# EAGLE design core09e2 (EAGLE 6.6.0)

## Sheet 1 of 3
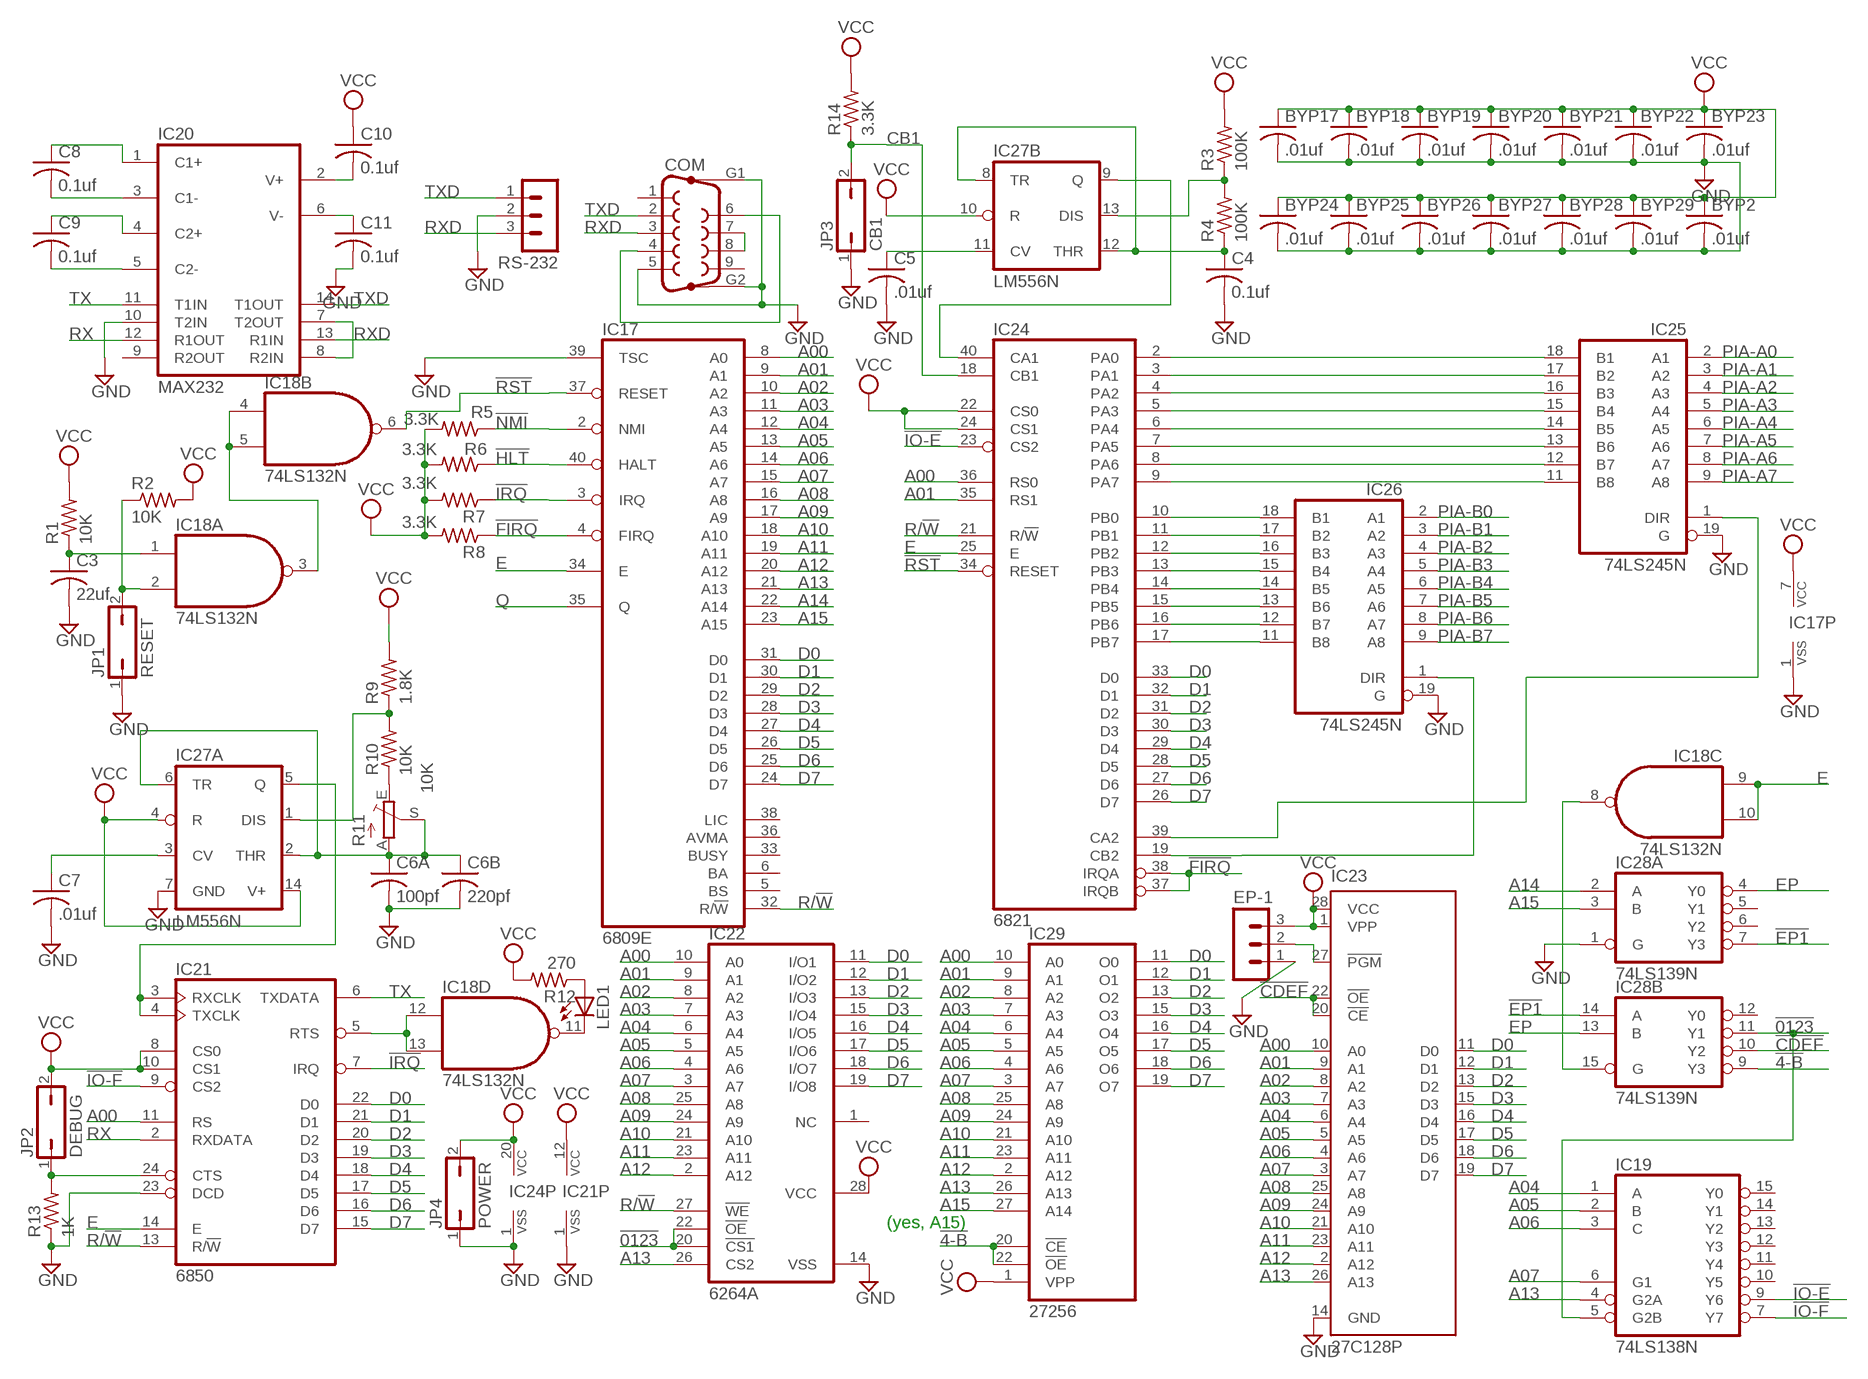
[diagram p0: schematic, sheet 1]

### Parts
BYP2  .01uf  C-US050-025X075  [C050-025X075]
BYP17  .01uf  C-US050-025X075  [C050-025X075]
BYP18  .01uf  C-US050-025X075  [C050-025X075]
BYP19  .01uf  C-US050-025X075  [C050-025X075]
BYP20  .01uf  C-US050-025X075  [C050-025X075]
BYP21  .01uf  C-US050-025X075  [C050-025X075]
BYP22  .01uf  C-US050-025X075  [C050-025X075]
BYP23  .01uf  C-US050-025X075  [C050-025X075]
BYP24  .01uf  C-US050-025X075  [C050-025X075]
BYP25  .01uf  C-US050-025X075  [C050-025X075]
BYP26  .01uf  C-US050-025X075  [C050-025X075]
BYP27  .01uf  C-US050-025X075  [C050-025X075]
BYP28  .01uf  C-US050-025X075  [C050-025X075]
BYP29  .01uf  C-US050-025X075  [C050-025X075]
C3  22uf  C-US102-054X133  [C102-054X133]
C4  0.1uf  C-US050-025X075  [C050-025X075]
C5  .01uf  C-US050-025X075  [C050-025X075]
C6A  100pf  C-US050-025X075  [C050-025X075]
C6B  220pf  C-US050-025X075  [C050-025X075]
C7  .01uf  C-US050-025X075  [C050-025X075]
C8  0.1uf  C-US050-025X075  [C050-025X075]
C9  0.1uf  C-US050-025X075  [C050-025X075]
C10  0.1uf  C-US050-025X075  [C050-025X075]
C11  0.1uf  C-US050-025X075  [C050-025X075]
COM  F09HP  [F09HP]
EP-1  MA03-1  [MA03-1]
IC17  6809E  [DIL40]
IC18  74LS132N  74LS00N  [DIL14]
IC19  74LS138N  [DIL16]
IC20  MAX232  [DIL16]
IC21  6850  [DIL24]
IC22  6264A  [DIL28-6]
IC23  27C128P  [DIL28-6]
IC24  6821  [DIL40]
IC25  74LS245N  [DIL20]
IC26  74LS245N  [DIL20]
IC27  LM556N  [DIL14]
IC28  74LS139N  [DIL16]
IC29  27256  [DIL28]
JP1  RESET  JP1Q  [JP1]
JP2  DEBUG  JP1Q  [JP1]
JP3  CB1  JP1Q  [JP1]
JP4  POWER  JP1Q  [JP1]
LED1  LED3MM  [LED3MM]
R1  10K  R-US_0207/7  [0207/7]
R2  10K  R-US_0207/7  [0207/7]
R3  100K  R-US_0207/7  [0207/7]
R4  100K  R-US_0207/7  [0207/7]
R5  3.3K  R-US_0207/7  [0207/7]
R6  3.3K  R-US_0207/7  [0207/7]
R7  3.3K  R-US_0207/7  [0207/7]
R8  3.3K  R-US_0207/7  [0207/7]
R9  1.8K  R-US_0207/7  [0207/7]
R10  10K  R-US_0207/7  [0207/7]
R11  10K  TRIM_EU-B90P  [SP19L]
R12  270  R-US_0207/7  [0207/7]
R13  1K  R-US_0207/7  [0207/7]
R14  3.3K  R-US_0207/7  [0207/7]
RS-232  MA03-1  [MA03-1]

### Nets
!4-B: IC28.9(B:Y3) IC29.20(!CE) IC29.22(!OE)
!0123: IC19.5(G2B) IC22.20(!CS1) IC22.22(!OE) IC28.11(B:Y1)
!CDEF: IC23.20(!CE) IC23.22(!OE) IC28.10(B:Y2)
!EP1: IC28.7(A:Y3) IC28.14(B:A)
!FIRQ: IC17.4(FIRQ) IC24.37(IRQB) IC24.38(IRQA) R8.1
!HLT: IC17.40(HALT) R5.1
!IO-E: IC19.9(Y6) IC24.23(CS2)
!IO-F: IC19.7(Y7) IC21.9(CS2)
!IRQ: IC17.3(IRQ) IC21.7(IRQ) R7.1
!NMI: IC17.2(NMI) R6.1
!RST: IC17.37(RESET) IC18.6(B:O) IC24.34(RESET)
A00: IC17.8(A0) IC21.11(RS) IC22.10(A0) IC23.10(A0) IC24.36(RS0) IC29.10(A0)
A01: IC17.9(A1) IC22.9(A1) IC23.9(A1) IC24.35(RS1) IC29.9(A1)
A02: IC17.10(A2) IC22.8(A2) IC23.8(A2) IC29.8(A2)
A03: IC17.11(A3) IC22.7(A3) IC23.7(A3) IC29.7(A3)
A04: IC17.12(A4) IC19.1(A) IC22.6(A4) IC23.6(A4) IC29.6(A4)
A05: IC17.13(A5) IC19.2(B) IC22.5(A5) IC23.5(A5) IC29.5(A5)
A06: IC17.14(A6) IC19.3(C) IC22.4(A6) IC23.4(A6) IC29.4(A6)
A07: IC17.15(A7) IC19.6(G1) IC22.3(A7) IC23.3(A7) IC29.3(A7)
A08: IC17.16(A8) IC22.25(A8) IC23.25(A8) IC29.25(A8)
A09: IC17.17(A9) IC22.24(A9) IC23.24(A9) IC29.24(A9)
A10: IC17.18(A10) IC22.21(A10) IC23.21(A10) IC29.21(A10)
A11: IC17.19(A11) IC22.23(A11) IC23.23(A11) IC29.23(A11)
A12: IC17.20(A12) IC22.2(A12) IC23.2(A12) IC29.2(A12)
A13: IC17.21(A13) IC19.4(G2A) IC22.26(CS2) IC23.26(A13) IC29.26(A13)
A14: IC17.22(A14) IC28.2(A:A)
A15: IC17.23(A15) IC28.3(A:B) IC29.27(A14)
CB1: IC24.18(CB1) JP3.2 R14.1
D0: IC17.31(D0) IC21.22(D0) IC22.11(I/O1) IC23.11(D0) IC24.33(D0) IC29.11(O0)
D1: IC17.30(D1) IC21.21(D1) IC22.12(I/O2) IC23.12(D1) IC24.32(D1) IC29.12(O1)
D2: IC17.29(D2) IC21.20(D2) IC22.13(I/O3) IC23.13(D2) IC24.31(D2) IC29.13(O2)
D3: IC17.28(D3) IC21.19(D3) IC22.15(I/O4) IC23.15(D3) IC24.30(D3) IC29.15(O3)
D4: IC17.27(D4) IC21.18(D4) IC22.16(I/O5) IC23.16(D4) IC24.29(D4) IC29.16(O4)
D5: IC17.26(D5) IC21.17(D5) IC22.17(I/O6) IC23.17(D5) IC24.28(D5) IC29.17(O5)
D6: IC17.25(D6) IC21.16(D6) IC22.18(I/O7) IC23.18(D6) IC24.27(D6) IC29.18(O6)
D7: IC17.24(D7) IC21.15(D7) IC22.19(I/O8) IC23.19(D7) IC24.26(D7) IC29.19(O7)
E: IC17.34(E) IC18.9(C:I0) IC18.10(C:I1) IC21.14(E) IC24.25(E) ; also sheet 3
EP: IC28.4(A:Y0) IC28.13(B:B)
GND [Power]: BYP2.2 BYP17.2 BYP18.2 BYP19.2 BYP20.2 BYP21.2 BYP22.2 BYP23.2 BYP24.2 BYP25.2 BYP26.2 BYP27.2 BYP28.2 BYP29.2 C3.2 C4.2 C5.2 C6A.2 C6B.2 C7.2 C11.2 COM.5 COM.G1 COM.G2 EP-1.1 IC17.1(VSS) IC17.39(TSC) IC20.10(T2IN) IC21.1(VSS) IC21.23(DCD) IC22.14(VSS) IC23.14(GND) IC24.1(VSS) IC25.19(G) IC26.19(G) IC27.7(A:GND) IC28.1(A:G) JP1.1 JP3.1 JP4.1 R13.1 RS-232.2 ; also sheet 2,3
N$1: COM.4 COM.6
N$4: EP-1.2 IC23.27(!PGM)
N$5: IC24.2(PA0) IC25.18(B1)
N$6: IC18.3(A:O) IC18.4(B:I0) IC18.5(B:I1)
N$21: C3.1 IC18.1(A:I0) R1.1
N$22: IC18.2(A:I1) JP1.2 R2.1
N$23: IC21.3(RXCLK) IC21.4(TXCLK) IC27.5(A:Q)
N$24: IC24.10(PB0) IC26.18(B1)
N$25: IC24.11(PB1) IC26.17(B2)
N$27: C6A.1 C6B.1 IC27.2(A:THR) IC27.6(A:TR) R11.A R11.S
N$28: IC27.1(A:DIS) R9.1 R10.2
N$94: IC24.12(PB2) IC26.16(B3)
N$124: IC24.13(PB3) IC26.15(B4)
N$125: IC24.14(PB4) IC26.14(B5)
N$126: IC24.15(PB5) IC26.13(B6)
N$127: IC24.16(PB6) IC26.12(B7)
N$128: IC24.17(PB7) IC26.11(B8)
N$129: IC24.3(PA1) IC25.17(B2)
N$130: IC24.4(PA2) IC25.16(B3)
N$131: IC24.5(PA3) IC25.15(B4)
N$132: IC24.6(PA4) IC25.14(B5)
N$133: IC24.7(PA5) IC25.13(B6)
N$134: IC24.8(PA6) IC25.12(B7)
N$135: IC24.9(PA7) IC25.11(B8)
N$136: IC24.19(CB2) IC26.1(DIR)
N$137: IC24.39(CA2) IC25.1(DIR)
N$138: IC24.40(CA1) IC27.9(B:Q)
N$140: C4.1 IC27.8(B:TR) IC27.12(B:THR) R4.1
N$141: IC27.13(B:DIS) R3.1 R4.2
N$142: C5.1 IC27.11(B:CV)
N$143: R10.1 R11.E
N$145: COM.7 COM.8
N$147: IC18.12(D:I0) IC18.13(D:I1) IC21.5(RTS)
N$148: IC18.11(D:O) LED1.K(C)
N$149: LED1.A R12.1
N$150: IC21.24(CTS) JP2.1 R13.2
N$151: IC18.8(C:O) IC28.15(B:G)
N$153: IC20.7(T2OUT) IC20.8(R2IN)
N$154: C7.1 IC27.3(A:CV)
N$155: C9.2 IC20.5(C2-)
N$156: C9.1 IC20.4(C2+)
N$157: C8.2 IC20.3(C1-)
N$158: C8.1 IC20.1(C1+)
N$159: C11.1 IC20.6(V-)
N$160: C10.2 IC20.2(V+)
PIA-A0: IC25.2(A1) ; also sheet 2
PIA-A1: IC25.3(A2) ; also sheet 2
PIA-A2: IC25.4(A3) ; also sheet 2
PIA-A3: IC25.5(A4) ; also sheet 2
PIA-A4: IC25.6(A5) ; also sheet 2
PIA-A5: IC25.7(A6) ; also sheet 2
PIA-A6: IC25.8(A7) ; also sheet 2
PIA-A7: IC25.9(A8) ; also sheet 2
PIA-B0: IC26.2(A1) ; also sheet 2
PIA-B1: IC26.3(A2) ; also sheet 2
PIA-B2: IC26.4(A3) ; also sheet 2
PIA-B3: IC26.5(A4) ; also sheet 2
PIA-B4: IC26.6(A5) ; also sheet 2
PIA-B5: IC26.7(A6) ; also sheet 2
PIA-B6: IC26.8(A7) ; also sheet 2
PIA-B7: IC26.9(A8) ; also sheet 2
Q: IC17.35(Q) ; also sheet 3
R/!W: IC17.32(R/!W) IC21.13(R/!W) IC22.27(!WE) IC24.21(R/!W)
RX: IC20.12(R1OUT) IC21.2(RXDATA)
RXD: COM.3 IC20.13(R1IN) RS-232.3
TX: IC20.11(T1IN) IC21.6(TXDATA)
TXD: COM.2 IC20.14(T1OUT) RS-232.1
VCC [Power]: BYP2.1 BYP17.1 BYP18.1 BYP19.1 BYP20.1 BYP21.1 BYP22.1 BYP23.1 BYP24.1 BYP25.1 BYP26.1 BYP27.1 BYP28.1 BYP29.1 C10.1 EP-1.3 IC17.7(VCC) IC21.8(CS0) IC21.10(CS1) IC21.12(VCC) IC22.28(VCC) IC23.1(VPP) IC23.28(VCC) IC24.20(VCC) IC24.22(CS0) IC24.24(CS1) IC27.4(A:R) IC27.10(B:R) IC27.14(A:V+) IC29.1(VPP) JP2.2 JP4.2 R1.2 R2.2 R3.2 R5.2 R6.2 R7.2 R8.2 R9.2 R12.2 R14.2 ; also sheet 2,3
Unconnected: COM.1 COM.9 IC17.5(BS) IC17.6(BA) IC17.33(BUSY) IC17.36(AVMA) IC17.38(LIC) IC19.10(Y5) IC19.11(Y4) IC19.12(Y3) IC19.13(Y2) IC19.14(Y1) IC19.15(Y0) IC20.9(R2OUT) IC22.1(NC) IC28.5(A:Y1) IC28.6(A:Y2) IC28.12(B:Y0)

### Notes on the sheet
- (yes, A15)

## Sheet 2 of 3
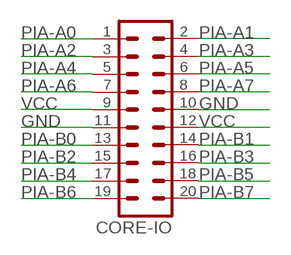
[diagram p1: schematic, sheet 2]

### Parts
CORE-IO  MA10-2  [MA10-2]

### Nets
GND [Power]: CORE-IO.10 CORE-IO.11 ; also sheet 1,3
PIA-A0: CORE-IO.1 ; also sheet 1
PIA-A1: CORE-IO.2 ; also sheet 1
PIA-A2: CORE-IO.3 ; also sheet 1
PIA-A3: CORE-IO.4 ; also sheet 1
PIA-A4: CORE-IO.5 ; also sheet 1
PIA-A5: CORE-IO.6 ; also sheet 1
PIA-A6: CORE-IO.7 ; also sheet 1
PIA-A7: CORE-IO.8 ; also sheet 1
PIA-B0: CORE-IO.13 ; also sheet 1
PIA-B1: CORE-IO.14 ; also sheet 1
PIA-B2: CORE-IO.15 ; also sheet 1
PIA-B3: CORE-IO.16 ; also sheet 1
PIA-B4: CORE-IO.17 ; also sheet 1
PIA-B5: CORE-IO.18 ; also sheet 1
PIA-B6: CORE-IO.19 ; also sheet 1
PIA-B7: CORE-IO.20 ; also sheet 1
VCC [Power]: CORE-IO.9 CORE-IO.12 ; also sheet 1,3

## Sheet 3 of 3
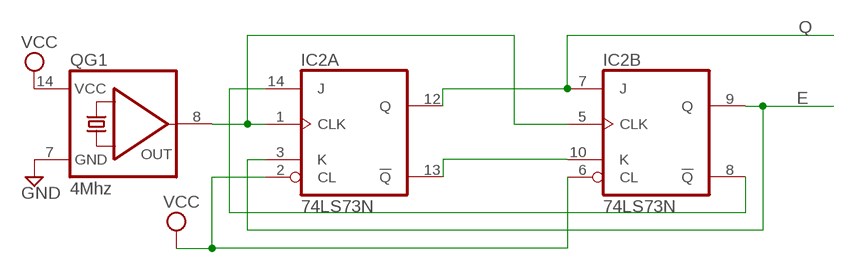
[diagram p2: schematic, sheet 3]

### Parts
IC2  74LS73N  [DIL14]
QG1  4Mhz  QG5860  [DIL14S]

### Nets
E: IC2.3(A:K) IC2.9(B:Q) ; also sheet 1
GND [Power]: QG1.7(GND) ; also sheet 1,2
N$2: IC2.1(A:CLK) IC2.5(B:CLK) QG1.8(OUT)
N$3: IC2.10(B:K) IC2.13(A:!Q)
N$7: IC2.8(B:!Q) IC2.14(A:J)
Q: IC2.7(B:J) IC2.12(A:Q) ; also sheet 1
VCC [Power]: IC2.2(A:CL) IC2.6(B:CL) QG1.14(VCC) ; also sheet 1,2

## Power pins joined to a net without a drawn wire
GND: IC2.11(P:GND) IC18.7(P:GND) IC19.8(GND) IC20.15(GND) IC25.10(GND) IC26.10(GND) IC28.8(P:GND) IC29.14(GND)
VCC: IC2.4(P:VCC) IC18.14(P:VCC) IC19.16(VCC) IC20.16(VCC) IC25.20(VCC) IC26.20(VCC) IC28.16(P:VCC) IC29.28(VCC)

## Library data of the parts
BYP2 BYP17-BYP29 C3-C5 C6A C6B C7-C11 = rcl:C-US: CAPACITOR, American symbol
COM = con-subd:F09HP: SUB-D; OC_FARNELL: unknown; OC_NEWARK: unknown
CORE-IO = con-lstb:MA10-2: PIN HEADER; OC_FARNELL: unknown; OC_NEWARK: unknown
EP-1 RS-232 = con-lstb:MA03-1: PIN HEADER; OC_FARNELL: unknown; OC_NEWARK: unknown
IC2 = 74xx-us:74*73: Dual J-K FLIP FLOP, clear
IC17 = micro-motorola:6809E: MICROCONTROLLER/MEMORY DEVICE; MF: NTE ELECTRONICS; MPN: NTE6809E; OC_FARNELL: unknown; OC_NEWARK: 31C5318
IC18 = 74xx-us:74*00: Quad 2-input NAND gate
IC19 = 74xx-us:74*138: 3-line to 8-line DECODER/DEMULTIPLEXER
IC20 = maxim:MAX232: RS232 TRANSCEIVER; MF: MAXIM; MPN: MAX232ACPE+; OC_FARNELL: 9723773; OC_NEWARK: 68K4544
IC21 = micro-motorola:6850: MICROCONTROLLER/MEMORY DEVICE; MF: NTE ELECTRONICS; MPN: NTE6850; OC_FARNELL: 4899775; OC_NEWARK: 31C2457
IC22 = memory-hitachi:6264A: MEMORY; OC_FARNELL: 283605; OC_NEWARK: unknown
IC23 = microchip:27*128: CMOS EPROM 128 K (16 K x 8); OC_FARNELL: unknown; OC_NEWARK: unknown
IC24 = micro-motorola:6821: MICROCONTROLLER/MEMORY DEVICE; MF: NTE ELECTRONICS; MPN: NTE6821; OC_FARNELL: 1652403; OC_NEWARK: 29C4772
IC25 IC26 = 74xx-us:74*245: Octal BUS TRANSCEIVER, 3-state
IC27 = linear:*556: Dual TIMER
IC28 = 74xx-us:74*139: Dual 2-line to 4-line DECODER/DEMULTIPLEXER
IC29 = memory:27256: MEMORY
JP1-JP4 = jumper:JP1Q: JUMPER
LED1 = led:LED: LED OSRAM: - CHIPLED LG R971, LG N971, LY N971, LG Q971, LY Q971, LO R971, LY R971 LH N974, LH R974 LS Q976, LO Q976, LY Q976 LO Q996 - Hyper CHIPLED LW Q18S LB Q993, LB Q99A, LB R99A - SideLED LS A670, LO A670, LY A670, LG A670, LP A670 LB A673, LV A673, LT A673, LW A673 LH A674 LY A675 LS A676, LA A676, LO A676, LY A676, LW A676 LS A679, LY A679, LG A679 - Hyper Micro SIDELED® LS Y876, LA Y876, LO Y876, LY Y876 LT Y87S - SmartLED LW L88C, LW L88S LB L89C, LB L89S, LG L890 LS L89K, LO L89K, LY L89K LS L896, LA L896, LO L896, LY L896 - TOPLED LS T670, LO T670, LY T670, LG T670, LP T670 LSG T670, LSP T670, LSY T670, LOP T670, LYG T670 LG T671, LOG T671, LSG T671 LB T673, LV T673, LT T673, LW T673 LH T674 LS T676, LA T676, LO T676, LY T676, LB T676, LH T676, LSB T676, LW T676 LB T67C, LV T67C, LT T67C, LS T67K, LO T67K, LY T67K, LW E67C LS E67B, LA E67B, LO E67B, LY E67B, LB E67C, LV E67C, LT E67C LW T67C LS T679, LY T679, LG T679 LS T770, LO T770, LY T770, LG T770, LP T770 LB T773, LV T773, LT T773, LW T773 LH T774 LS E675, LA E675, LY E675, LS T675 LS T776, LA T776, LO T776, LY T776, LB T776 LHGB T686 LT T68C, LB T68C - Hyper Mini TOPLED® LB M676 - Mini TOPLED Santana® LG M470 LS M47K, LO M47K, LY M47K Source: http://www.osram.convergy.de LUXEON: - LUMILED® LXK2-PW12-R00, LXK2-PW12-S00, LXK2-PW14-U00, LXK2-PW14-V00 LXK2-PM12-R00, LXK2-PM12-S00, LXK2-PM14-U00 LXK2-PE12-Q00, LXK2-PE12-R00, LXK2-PE12-S00, LXK2-PE14-T00, LXK2-PE14-U00 LXK2-PB12-K00, LXK2-PB12-L00, LXK2-PB12-M00, LXK2-PB14-N00, LXK2-PB14-P00, LXK2-PB14-Q00 LXK2-PR12-L00, LXK2-PR12-M00, LXK2-PR14-Q00, LXK2-PR14-R00 LXK2-PD12-Q00, LXK2-PD12-R00, LXK2-PD12-S00 LXK2-PH12-R00, LXK2-PH12-S00 LXK2-PL12-P00, LXK2-PL12-Q00, LXK2-PL12-R00 Source: www.luxeon.com KINGBRIGHT: KA-3528ASYC Source: www.kingbright.com
QG1 = crystal:QG5860: CRYSTAL RESONATOR; OC_FARNELL: unknown; OC_NEWARK: unknown
R1-R10 R12-R14 = rcl:R-US_: RESISTOR, American symbol
R11 = pot:TRIM_EU-: POTENTIOMETER

## Net classes
1 Power: width 0.508 mm, drill 0.254 mm, clearance 0.254 mm

## Board
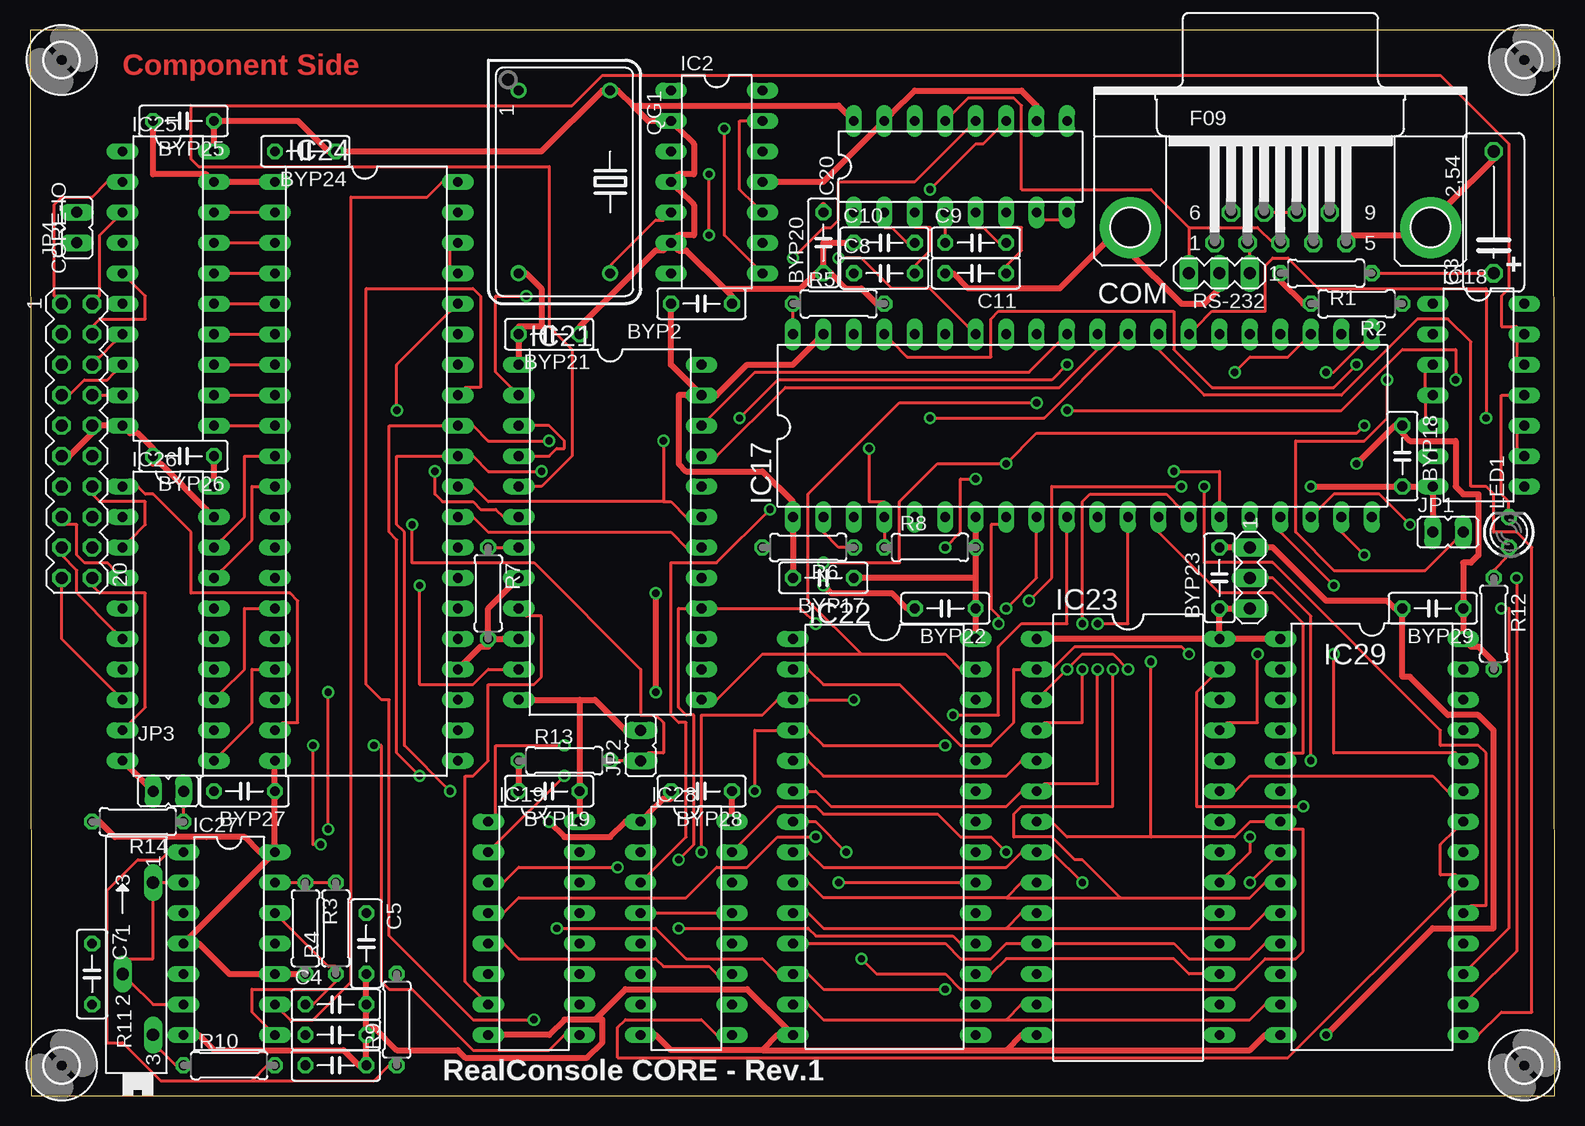
[diagram p3: board, top side]
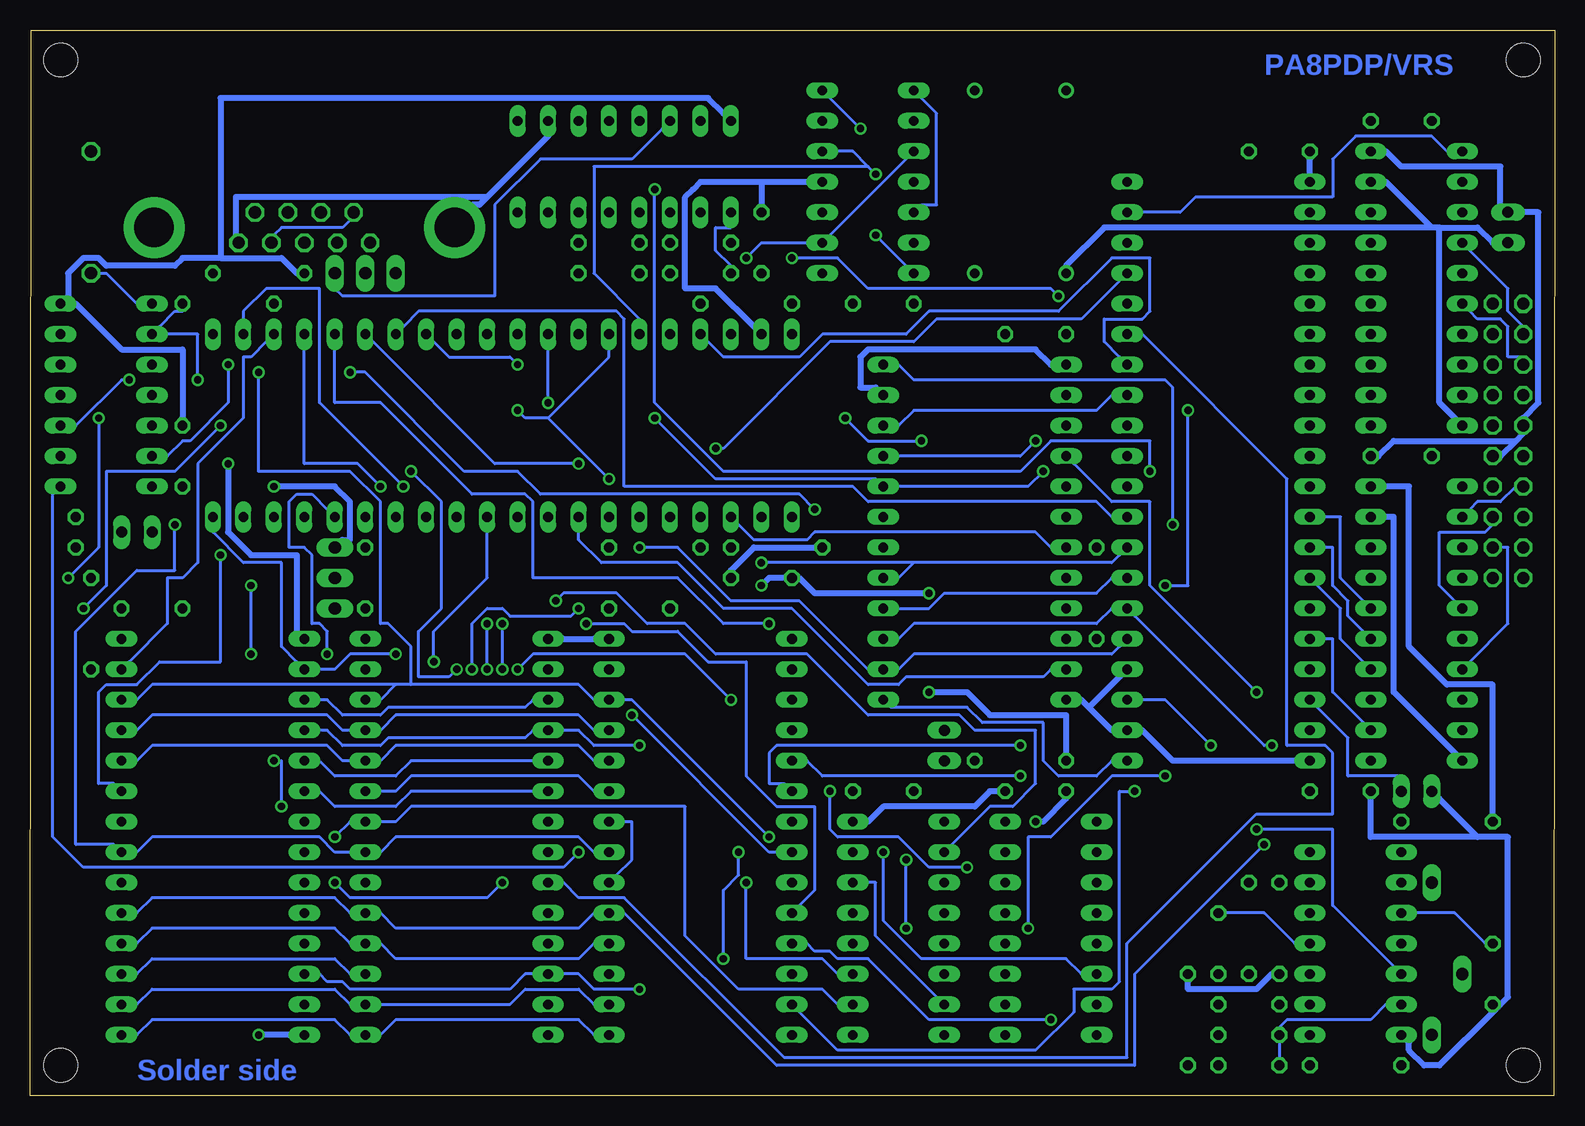
[diagram p4: board, bottom side, seen from below]

Size 127.11 x 88.87 mm. Coordinates in mm from the lower left corner, seen from the top.
Outline: 0.1,0 127.11,0 127.01,88.87 0,88.87 0.1,0
Copper layers (1*16): Top 0.035mm / dielectric 1.5mm / Bottom 0.035mm
Design rules "olimex10mil": minimum track width 10mil, minimum drill 24mil, track to track 10mil, track to pad 10mil, pad to pad 10mil, via to via 10mil, smd to smd 10mil, copper to edge 40mil, drill to drill 10mil, minimum pad ring 10mil, minimum via ring 8mil, stop-mask expansion 0mil, vias tented up to drill 0mil, thermal gap 10mil

### Footprints (pad centres in the part's own frame; a part is rotated, then mirrored left to right if it is on the bottom)
C050-025X075 = drill 0.813 octagon: 1 -2.54,0; 2 2.54,0
C102-054X133 = drill 1.016 octagon: 1 -5.08,0; 2 5.08,0
F09HP = drill 1.016 octagon: 1 -5.486,-1.27; 2 -2.743,-1.27; 3 0,-1.27; 4 2.743,-1.27; 5 5.486,-1.27; 6 -4.115,1.27; 7 -1.372,1.27; 8 1.372,1.27; 9 4.115,1.27 | drill 3.302 pad 5.08: G1 -12.522,0; G2 12.522,0
MA10-2 = drill 1.016 octagon: 1 -11.43,-1.27; 2 -11.43,1.27; 3 -8.89,-1.27; 4 -8.89,1.27; 5 -6.35,-1.27; 6 -6.35,1.27; 7 -3.81,-1.27; 8 -3.81,1.27; 9 -1.27,-1.27; 10 -1.27,1.27; 11 1.27,-1.27; 12 1.27,1.27; 13 3.81,-1.27; 14 3.81,1.27; 15 6.35,-1.27; 16 6.35,1.27; 17 8.89,-1.27; 18 8.89,1.27; 19 11.43,-1.27; 20 11.43,1.27
MA03-1 = drill 1.016 long: 1 -2.54,0; 2 0,0; 3 2.54,0
DIL14 = drill 0.813 long: 1 -7.62,-3.81; 2 -5.08,-3.81; 3 -2.54,-3.81; 4 0,-3.81; 5 2.54,-3.81; 6 5.08,-3.81; 7 7.62,-3.81; 8 7.62,3.81; 9 5.08,3.81; 10 2.54,3.81; 11 0,3.81; 12 -2.54,3.81; 13 -5.08,3.81; 14 -7.62,3.81
DIL40 = drill 0.813 long: 1 -24.13,-7.62; 2 -21.59,-7.62; 3 -19.05,-7.62; 4 -16.51,-7.62; 5 -13.97,-7.62; 6 -11.43,-7.62; 7 -8.89,-7.62; 8 -6.35,-7.62; 9 -3.81,-7.62; 10 -1.27,-7.62; 11 1.27,-7.62; 12 3.81,-7.62; 13 6.35,-7.62; 14 8.89,-7.62; 15 11.43,-7.62; 16 13.97,-7.62; 17 16.51,-7.62; 18 19.05,-7.62; 19 21.59,-7.62; 20 24.13,-7.62; 21 24.13,7.62; 22 21.59,7.62; 23 19.05,7.62; 24 16.51,7.62; 25 13.97,7.62; 26 11.43,7.62; 27 8.89,7.62; 28 6.35,7.62; 29 3.81,7.62; 30 1.27,7.62; 31 -1.27,7.62; 32 -3.81,7.62; 33 -6.35,7.62; 34 -8.89,7.62; 35 -11.43,7.62; 36 -13.97,7.62; 37 -16.51,7.62; 38 -19.05,7.62; 39 -21.59,7.62; 40 -24.13,7.62
DIL16 = drill 0.813 long: 1 -8.89,-3.81; 2 -6.35,-3.81; 3 -3.81,-3.81; 4 -1.27,-3.81; 5 1.27,-3.81; 6 3.81,-3.81; 7 6.35,-3.81; 8 8.89,-3.81; 9 8.89,3.81; 10 6.35,3.81; 11 3.81,3.81; 12 1.27,3.81; 13 -1.27,3.81; 14 -3.81,3.81; 15 -6.35,3.81; 16 -8.89,3.81
DIL24 = drill 0.813 long: 1 -13.97,-7.62; 2 -11.43,-7.62; 3 -8.89,-7.62; 4 -6.35,-7.62; 5 -3.81,-7.62; 6 -1.27,-7.62; 7 1.27,-7.62; 8 3.81,-7.62; 9 6.35,-7.62; 10 8.89,-7.62; 11 11.43,-7.62; 12 13.97,-7.62; 13 13.97,7.62; 14 11.43,7.62; 15 8.89,7.62; 16 6.35,7.62; 17 3.81,7.62; 18 1.27,7.62; 19 -1.27,7.62; 20 -3.81,7.62; 21 -6.35,7.62; 22 -8.89,7.62; 23 -11.43,7.62; 24 -13.97,7.62
DIL28-6 = drill 0.813 long: 1 -16.51,-7.62; 2 -13.97,-7.62; 3 -11.43,-7.62; 4 -8.89,-7.62; 5 -6.35,-7.62; 6 -3.81,-7.62; 7 -1.27,-7.62; 8 1.27,-7.62; 9 3.81,-7.62; 10 6.35,-7.62; 11 8.89,-7.62; 12 11.43,-7.62; 13 13.97,-7.62; 14 16.51,-7.62; 15 16.51,7.62; 16 13.97,7.62; 17 11.43,7.62; 18 8.89,7.62; 19 6.35,7.62; 20 3.81,7.62; 21 1.27,7.62; 22 -1.27,7.62; 23 -3.81,7.62; 24 -6.35,7.62; 25 -8.89,7.62; 26 -11.43,7.62; 27 -13.97,7.62; 28 -16.51,7.62
DIL20 = drill 0.813 long: 1 -11.43,-3.81; 2 -8.89,-3.81; 3 -6.35,-3.81; 4 -3.81,-3.81; 5 -1.27,-3.81; 6 1.27,-3.81; 7 3.81,-3.81; 8 6.35,-3.81; 9 8.89,-3.81; 10 11.43,-3.81; 11 11.43,3.81; 12 8.89,3.81; 13 6.35,3.81; 14 3.81,3.81; 15 1.27,3.81; 16 -1.27,3.81; 17 -3.81,3.81; 18 -6.35,3.81; 19 -8.89,3.81; 20 -11.43,3.81
DIL28 = drill 0.813 long: 1 -16.51,-7.62; 2 -13.97,-7.62; 3 -11.43,-7.62; 4 -8.89,-7.62; 5 -6.35,-7.62; 6 -3.81,-7.62; 7 -1.27,-7.62; 8 1.27,-7.62; 9 3.81,-7.62; 10 6.35,-7.62; 11 8.89,-7.62; 12 11.43,-7.62; 13 13.97,-7.62; 14 16.51,-7.62; 15 16.51,7.62; 16 13.97,7.62; 17 11.43,7.62; 18 8.89,7.62; 19 6.35,7.62; 20 3.81,7.62; 21 1.27,7.62; 22 -1.27,7.62; 23 -3.81,7.62; 24 -6.35,7.62; 25 -8.89,7.62; 26 -11.43,7.62; 27 -13.97,7.62; 28 -16.51,7.62
JP1 = drill 0.914 long: 1 0,-1.27; 2 0,1.27
LED3MM = drill 0.813 octagon: A -1.27,0; K 1.27,0
DIL14S = drill 0.813: 1 -7.62,-3.81; 7 7.62,-3.81; 8 7.62,3.81; 14 -7.62,3.81
0207/7 = drill 0.813 octagon: 1 -3.81,0; 2 3.81,0
SP19L = drill 1.016 long: A 5.715,-1.27; E -6.985,-1.27; S -1.905,1.27
2,8 = hole 2.8: 0,0

### Placement (x,y rotation side)
BYP2  55.98,66.05 180 top
BYP17  66.14,43.19 180 top
BYP18  114.4,53.35 270 top
BYP19  43.28,25.41 180 top
BYP20  66.14,71.13 90 top
BYP21  43.28,63.51 180 top
BYP22  76.3,40.65 180 top
BYP23  99.16,43.19 90 top
BYP24  22.96,78.75 180 top
BYP25  12.8,81.29 180 top
BYP26  12.8,53.35 180 top
BYP27  17.88,25.41 180 top
BYP28  55.98,25.41 180 top
BYP29  116.94,40.65 180 top
C3  122.02,73.67 90 top
C4  25.5,7.63 0 top
C5  28.04,12.71 270 top
C6A  25.5,5.09 0 top
C6B  25.5,2.55 0 top
C7  5.18,10.17 270 top
C8  71.22,68.59 0 top
C9  78.84,71.13 0 top
C10  71.22,71.13 0 top
C11  78.84,68.59 180 top
COM  104.24,72.4 0 top
CORE-IO  3.91,54.62 270 top
EP-1  101.7,43.19 270 top
IC2  57.25,76.21 270 top
IC17  87.73,55.89 0 top
IC18  120.75,58.43 270 top
IC19  42.01,13.98 270 top
IC20  77.57,77.48 0 top
IC21  48.36,47 270 top
IC22  71.22,21.6 270 top
IC23  91.54,21.6 270 top
IC24  28.04,52.08 270 top
IC25  11.53,67.32 270 top
IC26  11.53,39.38 270 top
IC27  16.61,12.71 270 top
IC28  54.71,13.98 270 top
IC29  111.86,21.6 270 top
JP1  118.21,47 270 top
JP2  50.9,29.22 0 top
JP3  11.53,25.41 270 top
JP4  3.91,72.4 0 top
LED1  123.29,47 90 top
QG1  44.55,76.21 270 top
R1  108.05,68.59 180 top
R2  110.59,66.05 180 top
R3  22.96,13.98 270 top
R4  25.5,13.98 90 top
R5  67.41,66.05 0 top
R6  64.87,45.73 180 top
R7  38.2,41.92 270 top
R8  75.03,45.73 0 top
R9  30.58,6.36 90 top
R10  16.61,2.55 0 top
R11  8.99,12.08 90 top
R12  122.02,39.38 270 top
R13  44.55,27.95 0 top
R14  8.99,22.87 180 top
RS-232  99.16,68.59 180 top
U$3  [2,8]  2.64,86.37 0 top
U$4  [2,8]  2.64,2.55 0 top
U$5  [2,8]  124.56,86.37 0 top
U$6  [2,8]  124.56,2.55 0 top

### Tracks (layer width: path | path; a pad name or v marks a point on that pad's centre or on a via)
!4-B
  Top 0.254: IC28.9 57.25,5.09 55.98,6.36 49.63,6.36 48.99,5.73 48.99,3.19 104.87,3.19 118.84,17.16 IC29.20 118.84,18.43 117.57,18.43 117.57,20.97 118.84,22.24 IC29.22
!0123  (via drill 0.61)
  Top 0.254: IC28.11 57.25,10.17 56.61,10.81 52.8,10.81 52.17,11.44 40.74,11.44 39.47,12.71 IC19.5 | v67.41,17.79 77.57,17.79 IC22.20
  Bottom 0.254: IC22.20 78.2,18.43 76.93,19.7 76.93,22.87 77.57,22.87 IC22.22 | v67.41,17.79 67.41,11.44 61.06,11.44 59.79,10.17 IC28.11
!CDEF  (via drill 0.61)
  Top 0.254: v101.7,21.6 101.7,20.33 99.79,18.43 IC23.20
  Bottom 0.254: IC28.10 59.79,7.63 61.06,8.9 68.04,8.9 72.49,13.35 72.49,24.14 95.35,24.14 96.62,22.87 97.89,22.87 IC23.22 100.43,22.87 v101.7,21.6
!EP1
  Bottom 0.254: IC28.7 51.53,8.27 56.61,13.35 56.61,17.79 57.25,17.79 IC28.14
!FIRQ  (via drill 0.61)
  Top 0.254: IC24.37 35.02,69.23 35.02,70.5 IC24.38 | R8.1 71.22,46.37 71.22,47 IC17.4 71.22,49.54 69.95,49.54 v69.95,53.99
  Bottom 0.254: v69.95,53.99 69.31,53.99 60.42,62.88 53.44,62.88 51.53,64.78 39.47,64.78 36.29,67.96 IC24.37
!HLT
  Top 0.254: IC17.40 63.6,64.78 63.6,65.42 R5.1
!IO-E  (via drill 0.61)
  Top 0.254: v28.67,29.22 29.31,29.22 29.31,9.54 29.94,8.9 31.85,8.9 36.93,3.82 43.28,3.82 44.55,5.09 IC19.9
  Bottom 0.254: v28.67,29.22 32.48,33.03 34.39,33.03 IC24.23
!IO-F
  Top 0.254: IC19.7 37.56,8.27 36.29,9.54 36.29,26.68 36.93,26.68 38.2,27.95 38.2,34.3 42.01,34.3 42.64,34.94 42.64,40.02 41.37,40.02 IC21.9
!IRQ
  Top 0.254: R7.1 38.83,45.73 39.47,45.73 IC21.7
  Bottom 0.254: IC17.3 68.04,47.64 66.77,46.37 62.33,46.37 61.69,47 43.28,47 42.01,45.73 IC21.7
!NMI
  Top 0.254: IC17.2 66.14,47 67.41,45.73 68.04,45.73 R6.1
!RST  (via drill 0.61)
  Top 0.254: v110.59,60.97 108.68,59.07 98.52,59.07 95.35,62.24 95.35,65.42 80.74,65.42 80.11,64.78 80.11,61.61 73.12,61.61 71.85,62.88 IC17.37
  Bottom 0.254: IC24.34 36.29,61.61 37.56,62.88 37.56,64.78 34.39,64.78 33.75,65.42 33.75,69.86 36.93,69.86 41.37,65.42 52.17,65.42 54.07,63.51 61.06,63.51 62.96,61.61 69.31,61.61 70.58,62.88 IC17.37 | v110.59,60.97 110.59,57.8 113.76,54.62 114.4,54.62 115.67,53.35 IC18.6
A00  (via drill 0.61)
  Top 0.254: 81.38,13.98 66.14,13.98 64.87,15.25 IC22.10 | 81.38,13.98 82.65,15.25 IC23.10 | 81.38,13.98 101.7,13.98 102.97,15.25 IC29.10 | v30.58,57.16 30.58,60.97 35.02,65.42 IC24.36 | v32.48,42.56 32.48,34.3 36.93,34.3 38.2,35.57 39.47,35.57 IC21.11 | v80.74,39.38 80.74,40.02 80.11,40.65 80.11,47.64 80.74,47.64 IC17.8
  Bottom 0.254: IC21.11 42.01,35.57 42.64,34.94 54.07,34.94 54.71,34.3 57.25,34.3 63.6,40.65 69.31,40.65 73.12,44.46 79.47,44.46 81.38,46.37 81.38,47 IC17.8 | v30.58,57.16 30.58,42.56 v32.48,42.56 | v80.74,39.38 77.57,39.38 76.93,38.75 73.12,38.75 70.58,36.21 67.41,36.21 67.41,26.68 64.87,24.14 61.69,24.14 61.69,17.16 62.96,15.89 IC22.10
A01  (via drill 0.61)
  Top 0.254: 81.38,16.52 66.14,16.52 64.87,17.79 IC22.9 | 81.38,16.52 82.65,17.79 IC23.9 | 81.38,16.52 90.9,16.52 | 90.9,16.52 101.7,16.52 102.97,17.79 IC29.9 | v81.38,40.65 83.92,43.19 83.92,47 IC17.9 | v90.27,35.57 90.27,24.14 82.65,24.14 82.01,23.51 82.01,21.6 85.19,21.6 87.09,19.7 87.73,19.7 90.9,16.52
  Bottom 0.254: v81.38,40.65 82.01,40.02 87.09,40.02 87.73,40.65 89,40.65 90.27,39.38 v90.27,35.57 | IC24.35 34.39,63.51 22.32,51.45 22.32,29.22 19.15,29.22 18.51,28.59 18.51,23.51 24.86,23.51 35.66,12.71 35.66,3.19 64.23,3.19 77.57,16.52 81.38,16.52 82.65,17.79 IC23.9
A02  (via drill 0.61)
  Top 0.254: IC22.8 64.87,20.33 66.14,19.06 81.38,19.06 82.65,20.33 IC23.8 85.19,20.33 v87.73,17.79 | v101.7,17.79 103.6,19.7 IC29.8 | v76.93,31.76 80.74,31.76 80.74,37.48 82.65,39.38 86.46,39.38 86.46,47 IC17.10
  Bottom 0.254: v101.7,17.79 100.43,16.52 89,16.52 v87.73,17.79 | v76.93,31.76 65.5,20.33 64.87,20.33 IC22.8
A03  (via drill 0.61)
  Top 0.254: v68.04,20.33 65.5,22.87 64.87,22.87 IC22.7 | v69.31,11.44 70.58,10.17 76.3,10.17 77.57,8.9 100.43,8.9 102.97,11.44 105.51,11.44 106.14,12.08 106.14,22.24 104.87,22.24 IC29.7 102.97,22.87 101.7,22.87 100.43,21.6 93.44,21.6 | 93.44,21.6 86.46,21.6 85.19,22.87 IC23.7 | 93.44,21.6 v93.44,36.21
  Bottom 0.254: v68.04,20.33 68.04,18.43 69.31,17.16 v69.31,11.44 | v93.44,36.21 93.44,38.75 89,43.19 89,47 IC17.11
A04  (via drill 0.61)
  Top 0.254: v44.55,29.22 38.83,29.22 38.83,23.51 IC19.1 | IC22.6 64.87,25.41 65.5,25.41 66.77,24.14 81.38,24.14 82.65,25.41 IC23.6 84.55,26.05 89,26.05 v89,35.57 | v89,39.38 91.54,39.38 91.54,47 IC17.12
  Bottom 0.254: v44.55,29.22 64.87,29.22 65.5,28.59 65.5,26.05 64.23,26.05 IC22.6 | v89,35.57 v89,39.38 | IC29.6 102.97,25.41 101.7,24.14 96.62,24.14 95.35,25.41 85.19,25.41 IC23.6
A05  (via drill 0.61)
  Top 0.254: v44.55,26.68 38.83,20.97 IC19.2 | IC23.5 82.65,27.95 81.38,26.68 66.14,26.68 64.87,27.95 IC22.5 | IC17.13 94.08,47 99.16,41.92 103.6,41.92 106.14,39.38 106.14,28.59 104.87,28.59 IC29.5
  Bottom 0.254: v44.55,26.68 61.06,26.68 62.33,27.95 IC22.5 | IC29.5 102.97,27.95 101.7,26.68 96.62,26.68 95.35,27.95 85.19,27.95 IC23.5
A06  (via drill 0.61)
  Top 0.254: v48.99,19.06 40.74,19.06 39.47,17.79 IC19.3 | v60.42,25.41 60.42,30.49 62.33,30.49 IC22.4 64.87,30.49 66.14,29.22 v76.3,29.22 | v87.73,39.38 87.73,49.54 88.36,50.18 94.71,50.18 95.98,48.91 IC17.14 | v87.73,35.57 87.73,31.13 84.55,31.13 IC23.4
  Bottom 0.254: v48.99,19.06 52.17,19.06 54.71,21.6 59.79,21.6 60.42,22.24 v60.42,25.41 | IC29.4 102.97,30.49 102.33,30.49 101.06,29.22 97.89,29.22 97.25,29.86 85.82,29.86 85.19,30.49 IC23.4 82.65,30.49 81.38,30.49 80.11,29.22 v76.3,29.22 | v87.73,35.57 v87.73,39.38
A07  (via drill 0.61)
  Top 0.254: v55.98,20.33 55.98,31.76 61.06,31.76 62.33,33.03 IC22.3 64.87,33.03 v68.68,33.03 | IC23.3 84.55,33.67 v86.46,35.57 87.73,36.84 90.27,36.84 v91.54,35.57 | v95.35,52.08 99.16,52.08 99.16,49.54 IC17.15
  Bottom 0.254: IC23.3 85.19,33.03 85.82,32.4 97.25,32.4 97.89,31.76 101.06,31.76 102.33,33.03 102.97,33.03 IC29.3 | v55.98,20.33 55.98,14.62 52.8,11.44 40.74,11.44 39.47,10.17 IC19.6 | v86.46,35.57 85.19,36.84 72.49,36.84 v68.68,33.03 | v95.35,52.08 92.81,49.54 92.81,40.65 94.71,38.75 94.71,34.94 92.17,34.94 v91.54,35.57
A08  (via drill 0.61)
  Top 0.254: v102.33,36.84 102.33,31.13 99.79,31.13 IC23.25
  Bottom 0.254: IC22.25 80.11,30.49 81.38,31.76 96.62,31.76 97.89,30.49 IC23.25 100.43,30.49 101.06,30.49 102.33,31.76 116.94,31.76 118.21,30.49 IC29.25 | v102.33,36.84 102.33,38.75 102.97,39.38 103.6,39.38 103.6,45.1 104.24,45.73 105.51,45.73 105.51,49.54 104.87,50.18 103.6,50.18 102.33,48.91 IC17.16
A09  (via drill 0.61)
  Top 0.254: v108.68,42.56 104.24,47 IC17.17 | v108.68,36.84 108.68,28.59 118.84,28.59 IC29.24
  Bottom 0.254: IC22.24 80.11,27.95 81.38,29.22 96.62,29.22 97.89,27.95 IC23.24 100.43,27.95 101.06,27.95 102.33,29.22 116.94,29.22 118.21,27.95 IC29.24 | v108.68,36.84 v108.68,42.56
A10  (via drill 0.61)
  Top 0.254: v115.03,47.64 112.49,50.18 108.68,50.18 107.41,48.91 IC17.18
  Bottom 0.254: IC22.21 80.11,20.33 81.38,21.6 96.62,21.6 97.89,20.33 IC23.21 100.43,20.33 101.7,20.33 102.97,21.6 116.94,21.6 118.21,20.33 IC29.21 120.11,20.97 123.29,20.97 123.29,38.75 118.21,43.83 115.03,43.83 v115.03,47.64
A11  (via drill 0.61)
  Top 0.254: IC29.23 118.21,25.41 116.94,26.68 101.7,26.68 100.43,25.41 IC23.23 | v111.22,45.1 109.32,47 IC17.19
  Bottom 0.254: IC22.23 80.11,25.41 81.38,26.68 95.35,26.68 96.62,25.41 97.89,25.41 IC23.23 | v111.22,45.1 111.22,36.21 116.3,36.21 118.21,34.3 120.75,34.3 121.38,33.67 121.38,26.05 120.11,26.05 IC29.23
A12  (via drill 0.61)
  Top 0.254: IC22.2 64.87,35.57 66.14,34.3 72.49,34.3 77.57,29.22 80.11,29.22 82.01,31.13 82.01,35.57 82.65,35.57 IC23.2 85.19,35.57 87.09,37.48 95.98,37.48 v96.62,36.84
  Bottom 0.254: IC17.20 111.86,47 109.32,44.46 106.14,44.46 106.14,37.48 104.87,36.21 IC29.2 102.97,35.57 101.7,35.57 100.43,36.84 v96.62,36.84
A13  (via drill 0.61)
  Top 0.254: v65.5,21.6 62.33,21.6 59.79,19.06 57.25,19.06 54.71,16.52 40.74,16.52 39.47,15.25 IC19.4 | v108.05,60.34 108.68,60.34 111.22,62.88 IC17.21
  Bottom 0.254: v65.5,21.6 76.93,33.03 77.57,33.03 IC22.26 80.11,33.03 81.38,34.3 95.35,34.3 | 96.62,34.3 97.89,33.03 IC23.26 | 95.35,34.3 96.62,34.3 | 96.62,34.3 116.94,34.3 118.21,33.03 IC29.26 | v108.05,60.34 108.05,52.08 100.43,52.08 97.89,49.54 97.89,39.38 97.25,39.38 | 95.35,34.3 95.35,37.48 | 95.35,37.48 97.25,39.38 | 95.35,37.48 97.25,39.38
A14  (via drill 0.61)
  Top 0.254: v83.28,41.29 85.19,43.19 85.19,50.81 v95.98,50.81
  Bottom 0.254: v83.28,41.29 82.65,41.92 78.2,41.92 75.66,39.38 72.49,39.38 69.95,36.84 62.33,36.84 57.25,31.76 49.63,31.76 48.36,30.49 43.28,30.49 43.28,26.05 45.18,24.14 47.09,24.14 50.26,20.97 IC28.2 | v95.98,50.81 102.97,57.8 102.97,67.32 107.41,67.32 109.32,65.42 109.32,64.78 IC17.22
A15  (via drill 0.61)
  Top 0.254: v61.69,48.91 57.25,44.46 53.44,44.46 53.44,31.76 54.07,31.13 54.71,31.13 54.71,21.6 51.53,18.43 IC28.3 | v100.43,60.34 101.7,61.61 104.87,61.61 106.14,62.88 IC17.23
  Bottom 0.254: v61.69,48.91 62.96,50.18 84.55,50.18 86.46,52.08 90.9,52.08 99.16,60.34 v100.43,60.34 | IC29.27 118.84,36.21 115.67,39.38 115.67,43.19 114.4,43.19 113.13,44.46 113.13,52.72 109.32,56.53 109.32,61.61 108.68,61.61 107.41,62.88 IC17.23
CB1
  Top 0.254: R14.1 12.8,23.51 12.8,24.14 JP3.2
  Bottom 0.254: IC24.18 19.78,32.4 17.24,29.86 17.24,26.68 12.8,26.68 JP3.2
D0  (via drill 0.61)
  Top 0.254: IC22.11 64.87,12.71 76.3,12.71 77.57,11.44 80.11,11.44 81.38,12.71 82.65,12.71 IC23.11 85.19,12.71 95.35,12.71 96.62,11.44 101.7,11.44 102.97,12.71 IC29.11 | IC17.31 85.82,62.88 83.28,60.34 60.42,60.34 56.61,56.53 IC21.22 | v42.01,6.36 36.93,6.36 29.94,13.35 29.94,33.03 29.31,33.03 28.04,34.3 28.04,67.32 36.93,67.32 37.56,66.69 37.56,59.07 36.29,59.07 IC24.33
  Bottom 0.254: IC24.33 36.93,58.43 38.2,57.16 53.44,57.16 54.71,55.89 IC21.22 | v42.01,6.36 52.17,6.36 57.25,11.44 59.79,11.44 60.42,12.08 61.69,12.08 62.33,12.71 IC22.11
D1  (via drill 0.61)
  Top 0.254: v76.3,8.9 66.14,8.9 64.87,10.17 IC22.12 62.33,10.17 61.06,11.44 54.71,11.44 52.17,13.98 v43.91,13.98 | IC21.21 57.25,53.35 62.96,59.07 85.82,59.07 89,62.24 IC17.30 | v43.28,54.62 38.2,54.62 36.93,55.89 IC24.32 34.39,55.89 29.94,55.89 29.94,47 30.58,46.37 30.58,28.59 v32.48,26.68
  Bottom 0.254: v76.3,8.9 80.11,8.9 81.38,10.17 82.65,10.17 IC23.12 85.19,10.17 85.82,10.17 87.09,8.9 100.43,8.9 101.06,9.54 102.33,9.54 102.97,10.17 IC29.12 | v43.28,54.62 44.55,53.35 54.71,53.35 IC21.21 | v43.91,13.98 43.91,21.6 42.01,21.6 36.93,26.68 v32.48,26.68
D2  (via drill 0.61)
  Top 0.254: 81.38,6.36 66.14,6.36 64.87,7.63 IC22.13 | 81.38,6.36 82.65,7.63 IC23.13 | 81.38,6.36 101.7,6.36 102.97,7.63 IC29.13 | v42.64,52.08 38.2,52.08 36.93,53.35 IC24.31 34.39,53.35 30.58,53.35 30.58,47.64 31.21,47 31.21,29.22 v35.02,25.41 | v75.03,56.53 84.55,56.53 90.9,62.88 IC17.29
  Bottom 0.254: v42.64,52.08 43.91,50.81 54.71,50.81 IC21.20 56.61,51.45 69.95,51.45 v75.03,56.53 | v35.02,25.41 36.29,25.41 36.29,9.54 36.93,8.9 40.1,8.9 40.1,7 43.28,3.82 59.79,3.82 62.96,7 IC22.13
D3  (via drill 0.61)
  Top 0.254: 52.8,49.54 38.2,49.54 36.93,50.81 IC24.30 | 52.8,49.54 53.44,49.54 54.71,48.27 IC21.19 | IC17.28 94.08,62.24 97.89,58.43 109.32,58.43 115.67,64.78 118.21,64.78 120.11,62.88 120.11,50.81 121.38,50.81 122.02,50.18 122.02,47 123.92,47 125.19,45.73 125.19,7 122.65,7 120.75,5.09 IC29.15 | v52.8,54.62 52.8,49.54 | v59.15,56.53 62.33,59.7 85.19,59.7 v86.46,60.97
  Bottom 0.254: IC22.15 80.11,5.09 81.38,6.36 96.62,6.36 97.89,5.09 IC23.15 100.43,5.09 101.7,6.36 116.94,6.36 118.21,5.09 IC29.15 | v52.8,54.62 57.25,54.62 v59.15,56.53 | v86.46,60.97 87.09,61.61 92.17,61.61 93.44,62.88 IC17.28
D4  (via drill 0.61)
  Top 0.254: IC21.18 54.71,45.73 53.44,47 38.2,47 36.93,48.27 IC24.29 | v123.92,43.19 123.92,12.08 120.11,8.27 IC29.16 | v121.38,56.53 121.38,67.32 107.41,67.32 104.87,69.86 103.6,69.86 102.97,69.23 102.97,65.42 98.52,65.42 97.25,64.15 IC17.27
  Bottom 0.254: IC22.16 80.11,7.63 81.38,8.9 85.82,8.9 87.09,7.63 97.89,7.63 IC23.16 100.43,7.63 101.7,8.9 116.94,8.9 118.21,7.63 IC29.16 | IC17.27 95.98,64.15 94.71,65.42 78.2,65.42 77.57,64.78 77.57,50.81 58.52,50.81 57.25,49.54 38.2,49.54 36.93,48.27 IC24.29 | v123.92,43.19 121.38,45.73 v121.38,56.53
D5  (via drill 0.61)
  Top 0.254: IC22.17 80.11,10.17 81.38,11.44 95.35,11.44 96.62,10.17 97.89,10.17 IC23.17 | v66.14,44.46 72.49,44.46 72.49,49.54 75.66,52.72 v81.38,52.72 83.92,55.26 110.59,55.26 v111.22,55.89 | v122.65,40.65 123.29,40.65 123.29,13.98 120.11,10.81 IC29.17
  Bottom 0.254: IC29.17 118.21,10.17 116.94,11.44 101.7,11.44 100.43,10.17 IC23.17 | 53.44,44.46 54.71,43.19 IC21.17 | 53.44,44.46 36.93,44.46 36.29,45.1 IC24.28 | v81.38,52.72 88.36,52.72 98.52,62.88 IC17.26 | 53.44,44.46 v66.14,44.46 | v122.65,40.65 120.75,42.56 120.75,52.08 115.03,52.08 v111.22,55.89
D6  (via drill 0.61)
  Top 0.254: v65.5,39.38 64.23,40.65 57.25,40.65 IC21.16 54.71,40.65 54.07,40.65 54.07,32.4 54.71,31.76 55.34,31.76 55.34,20.97 v54.07,19.7 | v54.07,13.98 64.87,13.98 65.5,13.35 76.93,13.35 77.57,12.71 IC22.18
  Bottom 0.254: IC22.18 80.11,12.71 81.38,11.44 96.62,11.44 97.89,12.71 IC23.18 100.43,12.71 101.7,13.98 116.94,13.98 118.21,12.71 IC29.18 | IC24.27 36.93,43.19 38.2,41.92 50.9,41.92 52.17,40.65 54.71,40.65 IC21.16 | v65.5,39.38 69.31,39.38 73.12,43.19 85.19,43.19 85.19,49.54 85.82,50.18 90.27,50.18 97.89,57.8 101.7,57.8 101.7,62.24 IC17.25 | v54.07,13.98 v54.07,19.7
D7  (via drill 0.61)
  Top 0.254: v97.89,50.81 97.89,44.46 103.6,44.46 117.57,30.49 117.57,29.22 120.75,29.22 121.38,28.59 121.38,15.89 120.11,15.89 IC29.19 | v23.59,29.22 23.59,20.97 v24.23,20.97
  Bottom 0.254: IC21.15 54.71,38.11 53.44,39.38 38.2,39.38 36.93,40.65 IC24.26 35.02,40.02 24.23,29.22 v23.59,29.22 | IC29.19 118.21,15.25 116.94,16.52 101.7,16.52 100.43,15.25 IC23.19 97.89,15.25 96.62,13.98 81.38,13.98 80.11,15.25 IC22.19 77.57,15.25 64.87,2.55 35.02,2.55 35.02,10.17 v24.23,20.97 | v97.89,50.81 99.79,52.72 104.24,52.72 104.24,62.24 IC17.24
E  (via drill 0.61)
  Top 0.254: IC18.9 123.92,53.99 123.92,55.26 IC18.10 | v67.41,69.86 69.31,69.86 71.85,67.32 75.03,67.32 78.2,64.15 IC17.34 | v118.84,59.7 118.84,62.24 114.4,62.24 109.32,57.16 v86.46,57.16 | v76.3,45.73 77.57,47 77.57,51.45 v78.84,51.45
  Bottom 0.254: IC24.25 36.29,37.48 36.93,36.84 53.44,36.84 54.71,35.57 IC21.14 57.25,35.57 62.96,41.29 68.68,41.29 73.12,45.73 v76.3,45.73 | IC2.3 54.07,78.12 60.42,71.77 IC2.9 62.33,71.13 66.14,71.13 v67.41,69.86 | v118.84,59.7 119.48,59.7 123.29,55.89 IC18.10 | v86.46,57.16 85.82,56.53 83.92,56.53 | 83.92,56.53 78.84,61.61 78.84,62.24 IC17.34 | v78.84,51.45 83.92,56.53
EP
  Top 0.254: IC28.4 52.17,15.25 57.25,15.25 IC28.13
GND  (via drill 0.61)
  Top 0.508: IC27.7 14.07,5.09 15.34,3.82 26.13,3.82 27.4,2.55 C6B.2 28.04,3.19 28.04,4.46 C6A.2 | 28.04,5.73 28.04,7 C4.2 28.04,8.27 28.04,9.54 C5.2 | 47.09,6.36 44.55,6.36 43.28,5.09 39.47,5.09 IC19.8 | 47.09,6.36 49.63,8.9 59.79,8.9 62.96,5.73 IC22.14 62.33,5.09 61.06,3.82 | 61.06,3.82 53.44,3.82 52.17,5.09 IC28.8 | 81.38,3.82 82.65,5.09 IC23.14 | 61.06,3.82 81.38,3.82 | 81.38,3.82 101.7,3.82 102.97,5.09 IC29.14 | 47.09,6.36 47.72,6.36 47.72,4.46 46.45,3.19 36.29,3.19 35.66,3.82 30.58,3.82 28.67,5.73 28.04,5.73 | IC26.10 8.35,27.32 9.62,26.05 JP3.1 | IC26.19 14.7,48.91 10.89,52.72 10.26,52.72 BYP26.2 10.26,53.99 8.99,55.26 8.35,55.26 IC25.10 6.45,55.89 5.81,55.89 CORE-IO.10 5.18,55.26 3.27,53.35 CORE-IO.11 | IC21.1 40.74,61.61 40.74,62.88 BYP21.2 40.74,64.15 42.64,64.15 42.64,67.32 41.37,68.59 QG1.7 | IC24.1 19.15,76.21 16.61,76.21 IC25.19 14.7,76.85 10.26,76.85 10.26,80.66 BYP25.2 | COM.5 109.95,71.77 114.4,71.77 COM.G2 118.21,74.31 122.02,78.12 C3.2 | BYP20.2 66.14,74.31 | 70.58,80.66 IC20.15 | C11.2 76.93,68.59 78.2,67.32 85.82,67.32 89.63,71.13 COM.G1 91.54,70.5 95.98,66.05 97.89,66.05 99.16,67.32 RS-232.2 | IC20.15 71.85,81.93 73.76,83.83 82.65,83.83 83.92,82.56 IC20.10 | JP1.1 116.94,48.27 116.94,50.18 IC18.7 115.67,50.81 115.03,50.81 BYP18.2 113.76,50.81 v106.78,50.81 | BYP19.2 40.74,26.05 40.74,27.32 R13.1 | BYP28.2 53.44,24.78 52.8,24.78 51.53,23.51 IC28.1 49.63,22.87 48.36,21.6 44.55,21.6 v43.28,22.87 | BYP17.2 63.6,43.83 63.6,47 IC17.1 63.6,49.54 61.06,52.08 54.71,52.08 54.07,52.72 54.07,58.43 54.71,58.43 IC21.23 | IC21.23 55.34,59.07 53.44,60.97 53.44,65.42 BYP2.2
  Top 0.508: IC17.39 65.5,62.88 63.6,60.97 59.79,60.97 57.25,58.43 IC21.23 | v52.17,41.92 v52.17,33.67 | v66.14,42.56 66.77,41.92 71.85,41.92 73.12,40.65 BYP22.2 | 70.58,80.66 66.14,76.21 62.33,76.21 IC2.11 | 70.58,80.66 IC20.15 | BYP23.2 99.79,45.73 100.43,45.73 EP-1.1 102.97,45.73 103.6,45.73 108.05,41.29 113.13,41.29 113.76,40.65 BYP29.2 114.4,40.02 114.4,34.94 115.03,34.94 118.21,31.76 120.75,31.76 122.02,30.49 122.02,13.98 116.94,13.98 v108.05,5.09 | C6A.2 28.04,5.73 | C6A.2 28.04,5.73
  Bottom 0.508: IC26.10 8.35,28.59 13.43,33.67 13.43,48.27 14.07,48.27 IC26.19 | BYP24.2 20.42,78.12 20.42,76.85 IC24.1 | 9.62,72.4 10.26,72.4 | 9.62,72.4 6.45,72.4 5.18,71.13 JP4.1 | 10.26,72.4 14.07,76.21 IC25.19 | 10.26,72.4 37.56,72.4 40.74,69.23 QG1.7 | 9.62,72.4 9.62,57.8 8.35,56.53 IC25.10 | 89,74.94 89.63,74.31 90.27,74.31 COM.G1 | 89,74.94 83.92,80.02 IC20.10 | 89,74.94 109.95,74.94 109.95,71.77 COM.5 | v43.28,22.87 42.64,22.87 40.74,24.78 BYP19.2 | v52.17,33.67 48.99,33.67 47.09,31.76 40.74,31.76 40.74,28.59 R13.1 | v52.17,41.92 61.69,41.92 62.96,43.19 BYP17.2 64.23,43.19 65.5,43.19 v66.14,42.56 | IC17.39 66.77,64.15 69.95,67.32 72.49,67.32 72.49,74.94 71.85,75.58 71.22,76.21 66.14,76.21 | IC21.1 42.01,60.97 43.28,62.24 57.25,62.24 57.88,61.61 57.88,59.07 56.61,59.07 IC21.23 | 5.18,7 3.91,8.27 3.91,21.6 6.45,21.6 | 5.18,7 9.62,2.55 10.89,2.55 12.16,3.82 12.16,4.46 IC27.7 | 6.45,21.6 9.62,24.78 JP3.1 | 5.18,7 C7.2 | 66.14,76.21 62.33,76.21 IC2.11 | 66.14,76.21 66.14,74.31 BYP20.2 | 6.45,21.6 15.34,21.6 15.34,24.78 BYP27.2 | v106.78,50.81 101.7,50.81 100.43,49.54 100.43,46.37 101.06,46.37 EP-1.1 | v108.05,5.09 105.51,5.09 IC29.14
N$1
  Bottom 0.254: COM.6 100.43,73.04 101.06,72.4 106.14,72.4 106.78,71.77 COM.4
N$2
  Top 0.254: QG1.8 48.36,69.23 52.17,73.04 52.8,73.04 IC2.5
  Bottom 0.254: IC2.1 52.8,83.2 51.53,81.93 51.53,74.31 52.8,74.31 IC2.5
N$3
  Top 0.254: IC2.10 60.42,74.31 59.15,75.58 59.15,81.29 59.79,81.29 IC2.13
N$4  (via drill 0.61)
  Top 0.254: v106.14,24.14 97.25,24.14 97.25,33.67 98.52,34.94 IC23.27 | v106.78,27.95 106.78,40.02 103.6,43.19 102.97,43.19 EP-1.2
  Bottom 0.254: v106.14,24.14 106.14,27.95 v106.78,27.95
N$5
  Top 0.254: IC25.18 16.61,73.67 19.15,73.67 IC24.2
N$6
  Top 0.254: IC18.5 116.3,56.53 116.3,57.8 IC18.4 116.3,59.07 116.3,60.34 IC18.3
N$7  (via drill 0.61)
  Top 0.254: v57.88,80.66 57.88,71.77 60.42,69.23 IC2.8
  Bottom 0.254: v57.88,80.66 60.42,83.2 IC2.14
N$21
  Top 0.254: R1.1 112.49,68.59 121.38,68.59 C3.1
  Bottom 0.254: IC18.1 118.21,66.05 120.75,68.59 121.38,68.59 C3.1
N$22  (via drill 0.61)
  Top 0.254: v113.13,59.7 113.13,56.53 111.22,54.62 105.51,54.62 105.51,47 108.68,43.83 116.3,43.83 118.84,46.37 JP1.2
  Bottom 0.254: R2.1 114.4,65.42 115.03,65.42 116.3,64.15 IC18.2 115.67,63.51 113.13,63.51 v113.13,59.7
N$23  (via drill 0.61)
  Top 0.254: v24.86,22.24 v24.86,33.67 | IC21.3 42.01,55.89 43.28,55.89 44.55,54.62 44.55,53.99 43.91,53.99 43.28,53.35 42.01,53.35 IC21.4
  Bottom 0.254: v24.86,22.24 18.51,22.24 18.51,15.89 13.43,10.81 IC27.5 | v24.86,33.67 33.75,42.56 33.75,49.54 36.93,49.54 40.1,52.72 IC21.4
N$24
  Top 0.254: IC26.18 15.97,46.37 17.88,48.27 17.88,53.35 19.15,53.35 IC24.10
N$25
  Top 0.254: IC26.17 15.97,43.83 18.51,46.37 18.51,50.81 19.15,50.81 IC24.11
N$27
  Top 0.254: IC27.2 11.53,17.79 10.89,17.79 R11.A 10.26,16.52 10.26,11.44 7.72,11.44 R11.S 8.35,9.54 10.26,7.63 11.53,7.63 IC27.6
  Bottom 0.254: IC27.6 14.07,7.63 15.34,6.36 22.32,6.36 22.96,5.73 C6A.1 22.96,4.46 22.96,3.19 C6B.1
N$28
  Top 0.254: 18.51,1.28 10.89,1.28 7.72,4.46 6.45,4.46 6.45,17.16 8.99,19.7 10.89,19.7 11.53,20.33 IC27.1 | 18.51,1.28 19.78,2.55 R10.2 | 18.51,1.28 28.67,1.28 29.94,2.55 R9.1
N$94
  Bottom 0.254: IC26.16 15.97,41.29 17.88,43.19 17.88,48.27 19.15,48.27 IC24.12
N$124
  Bottom 0.254: IC26.15 15.97,38.75 17.24,40.02 17.24,41.29 18.51,42.56 18.51,45.73 19.15,45.73 IC24.13
N$125
  Bottom 0.254: IC26.14 15.97,36.21 17.88,38.11 17.88,40.65 19.78,42.56 IC24.14
N$126
  Top 0.254: IC26.13 15.97,33.67 17.88,35.57 17.88,40.65 19.15,40.65 IC24.15
N$127
  Bottom 0.254: IC26.12 15.97,31.13 18.51,33.67 18.51,38.11 19.15,38.11 IC24.16
N$128
  Top 0.254: IC26.11 15.97,28.59 18.51,31.13 18.51,35.57 19.15,35.57 IC24.17
N$129
  Top 0.254: IC25.17 16.61,71.13 19.15,71.13 IC24.3
N$130
  Top 0.254: IC25.16 16.61,68.59 19.15,68.59 IC24.4
N$131
  Top 0.254: IC25.15 16.61,66.05 19.15,66.05 IC24.5
N$132
  Top 0.254: IC25.14 16.61,63.51 19.15,63.51 IC24.6
N$133
  Top 0.254: IC25.13 16.61,60.97 19.15,60.97 IC24.7
N$134
  Top 0.254: IC25.12 16.61,58.43 19.15,58.43 IC24.8
N$135
  Top 0.254: IC25.11 16.61,55.89 19.15,55.89 IC24.9
N$136
  Top 0.254: IC26.1 8.99,50.81 9.62,50.18 10.26,50.18 13.43,47 13.43,41.92 21.69,41.92 22.32,41.29 22.32,31.13 21.05,31.13 IC24.19
N$137
  Bottom 0.254: IC25.1 8.99,78.75 10.26,80.02 16.61,80.02 18.51,78.12 18.51,74.94 29.94,74.94 31.21,73.67 34.39,73.67 IC24.39
N$138
  Top 0.254: IC27.9 21.05,7 21.69,6.36 23.59,6.36 26.77,9.54 26.77,74.94 33.12,74.94 34.39,76.21 IC24.40
N$140
  Top 0.254: 24.86,8.9 23.59,7.63 C4.1 | 24.86,8.9 25.5,9.54 R4.1 25.5,10.81 24.86,10.81 21.05,14.62 IC27.12 | 24.86,8.9 18.51,8.9 18.51,7 19.78,5.73 IC27.8
N$141
  Top 0.254: IC27.13 21.69,17.79 22.32,17.79 R3.1 23.59,17.79 24.86,17.79 R4.2
N$142
  Bottom 0.254: IC27.11 21.69,12.71 24.23,15.25 27.4,15.25 C5.1
N$143
  Top 0.254: R10.1 12.16,2.55 10.89,3.82 10.26,3.82 R11.E
N$145
  Top 0.254: COM.7 103.6,73.67 104.87,73.67 COM.8
N$147
  Top 0.254: IC18.12 123.92,61.61 123.92,62.88 IC18.13 123.92,64.15 122.65,64.15 122.65,66.69 123.29,67.32 123.29,79.39 117.57,85.1 47.72,85.1 45.18,82.56 13.43,82.56 13.43,78.12 14.07,77.48 43.28,77.48 43.28,64.15 45.18,62.24 45.18,53.35 42.64,50.81 42.01,50.81 IC21.5
N$148
  Top 0.254: LED1.K 123.29,48.91 123.29,49.54 122.65,50.18 122.65,58.43 123.29,58.43 IC18.11
N$149
  Top 0.254: R12.1 122.02,43.83 123.29,45.1 LED1.A
N$150  (via drill 0.61)
  Top 0.254: R13.2 48.99,27.95 49.63,27.95 JP2.1 51.53,28.59 52.8,28.59 52.8,31.13 52.17,31.76 50.9,31.76 50.9,35.57 42.01,44.46 31.85,44.46 v31.85,47.64
  Bottom 0.254: v31.85,47.64 31.85,59.07 32.48,59.7 53.44,59.7 54.71,60.97 IC21.24
N$151  (via drill 0.61)
  Top 0.254: v81.38,20.33 80.11,21.6 77.57,21.6 75.66,23.51 66.14,23.51 65.5,24.14 62.33,24.14 59.15,20.97 IC28.15
  Bottom 0.254: v81.38,20.33 82.65,19.06 122.65,19.06 125.19,21.6 125.19,50.18 IC18.8
N$153
  Top 0.254: IC20.7 84.55,73.04 85.82,73.04 IC20.8
N$154
  Bottom 0.254: C7.1 5.81,12.71 8.35,15.25 11.53,15.25 IC27.3
N$155
  Top 0.254: C9.2 80.74,71.13 79.47,72.4 78.84,72.4 IC20.5
N$156
  Top 0.254: C9.1 76.3,71.77 76.3,72.4 IC20.4
N$157
  Top 0.254: C8.2 73.76,69.23 75.03,70.5 75.03,72.4 73.76,72.4 IC20.3
N$158
  Bottom 0.254: C8.1 68.68,69.23 69.95,70.5 69.95,72.4 68.68,72.4 IC20.1
N$159
  Top 0.254: C11.1 81.38,69.23 82.65,70.5 82.65,72.4 81.38,72.4 IC20.6
N$160
  Top 0.254: C10.2 73.12,71.13 71.85,72.4 71.22,72.4 IC20.2
PIA-A0
  Top 0.254: IC25.2 6.45,76.21 5.18,74.94 2.64,74.94 2,74.31 2,66.69 2.64,66.69 CORE-IO.1
PIA-A1
  Top 0.254: IC25.3 7.08,73.04 5.81,71.77 5.81,66.69 5.18,66.69 CORE-IO.2
PIA-A2
  Bottom 0.254: IC25.4 7.08,70.5 3.91,67.32 3.91,65.42 2.64,64.15 CORE-IO.3
PIA-A3
  Top 0.254: IC25.5 8.35,67.96 9.62,66.69 9.62,64.78 5.81,64.78 5.18,64.15 CORE-IO.4
PIA-A4
  Bottom 0.254: IC25.6 7.08,65.42 6.45,64.78 4.54,64.78 3.91,64.15 3.91,61.61 2.64,61.61 CORE-IO.5
PIA-A5
  Top 0.254: IC25.7 7.08,62.88 5.81,61.61 5.18,61.61 CORE-IO.6
PIA-A6
  Top 0.254: IC25.8 7.08,60.34 6.45,59.7 4.54,59.7 3.27,58.43 CORE-IO.7
PIA-A7
  Top 0.254: IC25.9 6.45,58.43 5.81,58.43 CORE-IO.8
PIA-B0
  Bottom 0.254: IC26.2 7.08,48.91 6.45,49.54 4.54,49.54 3.27,50.81 CORE-IO.13
PIA-B1
  Top 0.254: IC26.3 8.35,46.37 9.62,47.64 9.62,49.54 5.81,49.54 5.18,50.18 CORE-IO.14
PIA-B2
  Top 0.254: IC26.4 7.08,43.83 6.45,44.46 4.54,44.46 3.91,45.1 3.91,47.64 2.64,47.64 CORE-IO.15
PIA-B3
  Bottom 0.254: IC26.5 8.35,41.29 9.62,42.56 9.62,47 5.81,47 5.18,47.64 CORE-IO.16
PIA-B4
  Top 0.254: IC26.6 7.08,38.75 3.91,41.92 3.91,43.83 2.64,45.1 CORE-IO.17
PIA-B5
  Bottom 0.254: IC26.7 7.08,36.21 3.91,39.38 3.91,45.73 4.54,45.73 CORE-IO.18
PIA-B6
  Top 0.254: IC26.8 7.08,33.67 2.64,38.11 2.64,42.56 CORE-IO.19
PIA-B7
  Top 0.254: IC26.9 8.35,31.13 9.62,32.4 9.62,41.92 5.81,41.92 5.18,42.56 CORE-IO.20
Q  (via drill 0.61)
  Top 0.254: v56.61,71.77 v56.61,76.85
  Bottom 0.254: v56.61,71.77 54.07,69.23 IC2.7 | 57.25,77.48 58.52,78.75 59.79,78.75 IC2.12 | v56.61,76.85 57.25,77.48 | 57.25,77.48 80.11,77.48 80.11,68.59 76.3,64.78 IC17.35
R/!W  (via drill 0.61)
  Top 0.254: 69.31,36.84 61.06,36.84 57.25,33.03 IC21.13 | 69.31,36.84 76.3,36.84 77.57,35.57 IC22.27 | v83.92,57.8 72.49,57.8 64.87,50.18 64.87,41.29 69.31,36.84
  Bottom 0.254: IC24.21 36.93,27.95 38.2,26.68 41.37,26.68 42.64,27.95 42.64,31.13 47.72,31.13 48.99,32.4 55.34,32.4 IC21.13 | v83.92,57.8 83.92,62.24 IC17.32
RX  (via drill 0.61)
  Top 0.254: v41.37,66.69 38.83,66.69 38.83,60.34 40.1,59.07 IC21.2 | v63.6,69.86 66.14,72.4 66.77,72.4 67.41,73.04 67.41,76.21 73.76,76.21 78.2,80.66 IC20.12
  Bottom 0.254: v41.37,66.69 42.01,67.32 57.25,67.32 59.79,69.86 v63.6,69.86
RXD
  Top 0.254: 96.62,72.4 93.44,75.58 82.65,75.58 82.65,82.56 82.01,83.2 78.2,83.2 76.93,81.93 IC20.13 | 96.62,72.4 96.62,69.86 RS-232.3 | 96.62,72.4 102.33,72.4 103.6,71.13 COM.3
TX  (via drill 0.61)
  Top 0.254: v33.75,52.08 33.75,50.18 34.39,49.54 36.93,49.54 37.56,48.91 38.83,48.91 39.47,48.27 IC21.6 | v75.03,75.58 78.84,79.39 79.47,79.39 80.74,80.66 IC20.11
  Bottom 0.254: v33.75,52.08 33.75,54.62 42.01,54.62 44.55,52.08 69.31,52.08 75.03,57.8 v75.03,75.58
TXD
  Top 0.254: COM.2 101.7,70.5 101.7,69.86 RS-232.1
  Bottom 0.254: IC20.14 74.39,80.66 76.93,78.12 84.55,78.12 88.36,74.31 88.36,66.69 101.06,66.69 101.7,67.32 RS-232.1
VCC  (via drill 0.61)
  Top 0.508: IC24.24 36.29,36.21 37.56,37.48 38.2,37.48 R7.2 | IC21.10 39.47,38.11 38.83,38.11 R7.2 | IC21.8 40.1,42.56 38.2,40.65 38.2,38.75 R7.2 | IC28.16 58.52,23.51 58.52,24.78 BYP28.1 | IC19.16 45.82,23.51 45.82,24.78 BYP19.1 45.82,26.05 45.82,33.03 | 45.82,33.03 42.01,33.03 IC21.12 | 45.82,33.03 47.09,33.03 49.63,30.49 JP2.2 | IC24.20 20.42,27.32 20.42,26.05 BYP27.1 20.42,24.78 20.42,20.97 IC27.14 | R14.2 5.81,22.87 7.08,21.6 14.7,21.6 17.88,21.6 19.15,20.33 IC27.14 | IC27.4 14.07,12.71 16.61,10.17 19.15,10.17 IC27.10 21.69,10.17 22.32,10.17 R3.2 | IC27.4 13.43,13.35 | IC29.1 102.97,38.11 100.43,38.11 IC23.28 | IC17.7 78.84,47 78.84,46.37 R8.2 78.84,45.1 78.84,43.19 | IC22.28 78.84,38.75 78.84,40.02 BYP22.1 78.84,41.29 78.84,43.19 | 78.84,43.19 69.31,43.19 BYP17.1 | IC23.28 97.89,38.11 85.19,38.11 IC23.1 | R12.2 122.02,36.21 120.75,37.48 120.11,37.48 IC29.28 119.48,38.75 119.48,40.02 BYP29.1 119.48,41.29 119.48,44.46 120.11,44.46 120.75,45.1 120.75,50.18 119.48,50.18 118.84,50.81 118.84,54.62 115.03,54.62 114.4,55.26 BYP18.1 113.76,55.89 v110.59,52.72 | R2.2 106.14,66.05 104.24,67.96 R1.2 | 50.26,82.56 51.53,81.29 52.17,81.29 IC2.2 54.07,80.66 55.34,79.39 55.34,76.85 54.07,76.85 IC2.4 54.07,75.58 55.34,74.31 55.34,71.77 54.07,71.77 IC2.6 | 50.26,82.56 48.99,83.83 QG1.14 47.72,83.83 42.64,78.75 26.13,78.75 BYP24.1 24.86,78.75 22.32,81.29 15.97,81.29 BYP25.1 15.34,80.66 15.34,79.39 IC25.20 | 50.26,82.56 67.41,82.56 68.04,81.93 IC20.16 | BYP20.1 66.14,69.23 66.14,71.13 68.04,71.13 C10.1 | R5.2 70.58,66.05 69.31,67.32 68.04,67.32 66.77,68.59 BYP20.1 | BYP21.1 45.82,64.15 52.17,70.5 52.8,70.5 IC2.6
  Top 0.508: 57.88,67.32 54.71,70.5 54.07,70.5 IC2.6 | 57.88,67.32 58.52,66.69 BYP2.1 | 57.88,67.32 64.23,67.32 65.5,68.59 BYP20.1 | IC26.20 15.34,51.45 15.34,52.72 BYP26.1 | 13.43,13.35 19.78,19.7 IC27.14 | IC27.4 13.43,13.35 | EP-1.3 100.43,40.65 99.79,40.65 BYP23.1 99.16,40.02 99.16,38.75 IC23.28
  Bottom 0.508: 38.83,32.4 39.47,33.03 IC21.12 | 38.83,32.4 36.93,30.49 IC24.22 34.39,30.49 31.85,27.95 21.69,27.95 IC24.20 | IC28.16 57.25,22.87 55.98,24.14 48.36,24.14 47.09,25.41 46.45,25.41 BYP19.1 | 38.83,32.4 36.29,34.94 IC24.24 | R3.2 23.59,10.17 24.86,8.9 30.58,8.9 30.58,9.54 R9.2 | R6.2 61.69,45.73 66.77,45.73 68.68,43.83 BYP17.1 | IC23.1 82.65,38.11 80.11,38.11 IC22.28 | BYP18.1 114.4,56.53 114.4,62.24 119.48,62.24 123.29,66.05 IC18.14 123.92,66.69 123.92,68.59 122.65,69.86 121.38,69.86 120.75,69.23 115.03,69.23 114.4,69.86 111.22,69.86 | 111.22,69.86 106.14,69.86 104.87,68.59 R1.2 | 3.27,54.62 2.64,55.26 CORE-IO.9 2.64,56.53 1.37,57.8 1.37,73.67 2.64,73.67 JP4.2 4.54,74.31 4.54,77.48 12.8,77.48 14.07,78.75 IC25.20 | 3.27,54.62 4.54,53.35 CORE-IO.12 | 3.27,54.62 13.43,54.62 14.7,53.35 BYP26.1 | 111.22,69.86 111.22,83.2 70.58,83.2 69.31,81.93 IC20.16 | v110.59,52.72 110.59,47 108.68,45.1 104.87,45.1 104.87,38.75 IC29.1 | R14.2 5.18,23.51 5.18,34.3 8.99,34.3 12.16,37.48 12.16,50.81 14.07,50.81 IC26.20

### Text on the board
Top: Component Side
Bottom: PA8PDP/VRS | Solder side
tPlace: + | RealConsole CORE - Rev.1
tValues: + | - | 27256 | 27128